# EAGLE schematic LM_180622 (EAGLE 7.7.1)

## Sheet 1 of 6
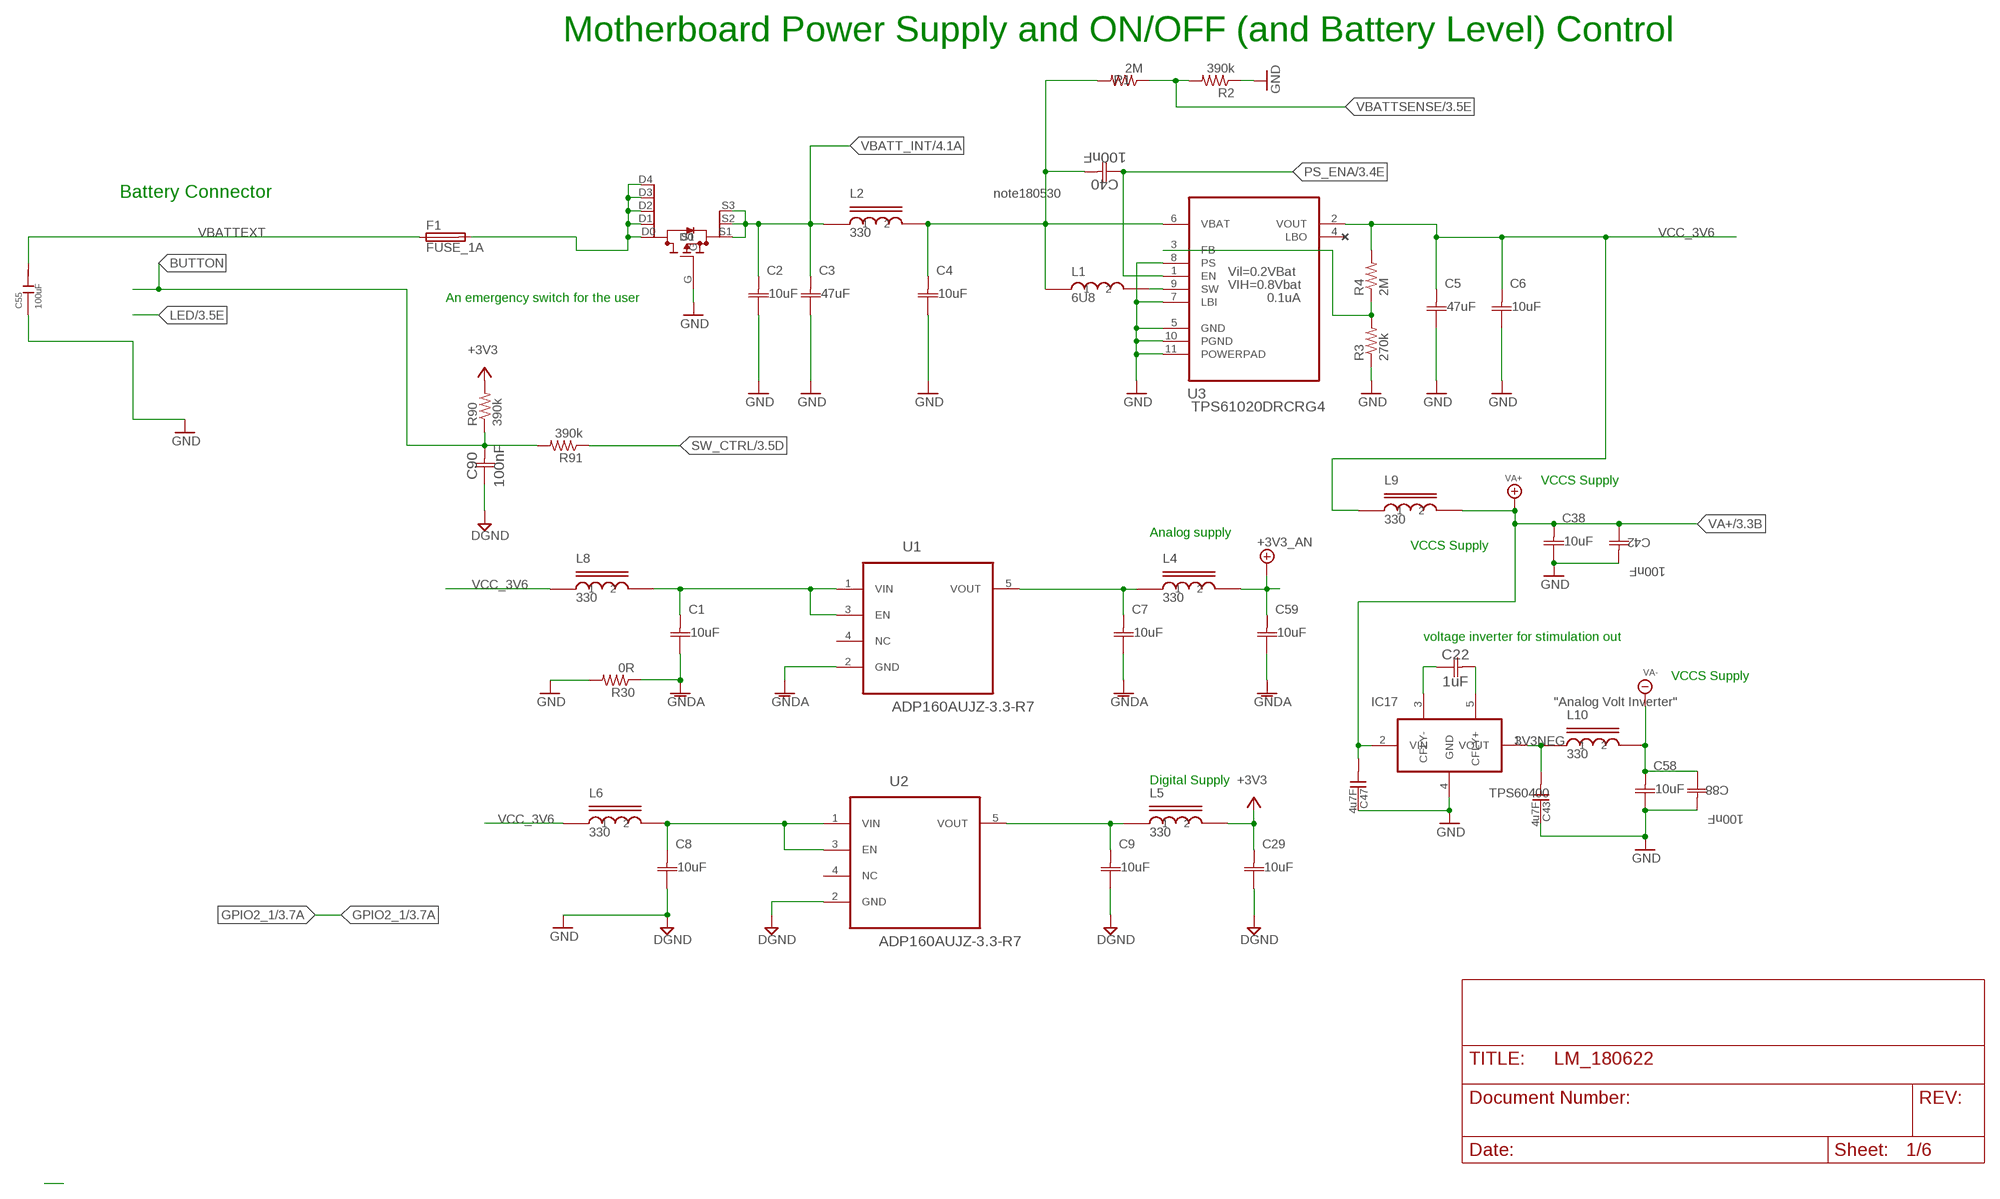
[diagram p0: schematic, sheet 1]

### Parts
C1  10uF  C0603C106M9PACTU  [C0603]
C2  10uF  C0603C106M9PACTU  [C0603]
C3  47uF  C0805C476M9PACTU  [C0805]
C4  10uF  C0603C106M9PACTU  [C0603]
C5  47uF  C0805C476M9PACTU  [C0805]
C6  10uF  C0603C106M9PACTU  [C0603]
C7  10uF  C0603C106M9PACTU  [C0603]
C8  10uF  C0603C106M9PACTU  [C0603]
C9  10uF  C0603C106M9PACTU  [C0603]
C22  1uF  C0603C105K3PACTU  [0603-CAP]
C29  10uF  C0603C106M9PACTU  [C0603]
C38  10uF  C0603C106M9PACTU  [C0603]
C40  100nF  C100NFC0603  [C0603]
C42  100nF  C100NFC0603  [C0603]
C43  4u7F  C0805_4U7  [C0805]
C47  4u7F  C0805_4U7  [C0805]
C55  100uF  C100UF-6V3-1210  [C1210]
C58  10uF  C0603C106M9PACTU  [C0603]
C59  10uF  C0603C106M9PACTU  [C0603]
C88  100nF  C100NFC0603  [C0603]
C90  100nF  C100NFC0603  [C0603]
F1  FUSE_1A  [C0805]
IC17  TPS60400  [SOT23-5]
L1  6U8  B82462G4682M  [SMT_POWER_IND_B82462G4]
L2  330  MMZ1608B301C  [L0603]
L4  330  MMZ1608B301C  [L0603]
L5  330  MMZ1608B301C  [L0603]
L6  330  MMZ1608B301C  [L0603]
L8  330  MMZ1608B301C  [L0603]
L9  330  MMZ1608B301C  [L0603]
L10  330  MMZ1608B301C  [L0603]
PMOS1  SIS407DN  [POWERPAK1212-8SINGLE]
R1  2M  R2MR0603  [R0603]
R2  390k  R390KR0603  [R0603]
R3  270k  R270KR0603  [R0603]
R4  2M  R2MR0603  [R0603]
R30  0R  R0RR0603  [R0603]
R90  390k  R390KR0603  [R0603]
R91  390k  R390KR0603  [R0603]
U1  ADP160AUJZ-3.3-R7  [SOT95P280X100-5N]
U2  ADP160AUJZ-3.3-R7  [SOT95P280X100-5N]
U3  TPS61020DRCRG4  [SON50P300X300X100-11N]

### Nets
3V3NEG [pwr]: C43.1 IC17.1(VOUT) L10.1
+3V3 [pwr]: C29.2(C2) L5.2 R90.2 ; also sheet 3,4
+3V3_AN [pwr]: C59.2(C2) L4.2 ; also sheet 2,3
A3V6 [pwr]: C1.2(C2) L8.2 U1.1(VIN) U1.3(EN)
BUTTON: C90.2(C2) R90.1 R91.2 ; also sheet 3
FB_3V6 [signal]: R3.2 R4.1 U3.3(FB)
GND [cGnd]: C2.1(C1) C3.1(C1) C4.1(C1) C5.1(C1) C6.1(C1) C8.1(C1) C9.1(C1) C29.1(C1) C38.1(C1) C42.2(C2) C43.2 C47.2 C55.1 C58.1(C1) C88.2(C2) C90.1(C1) IC17.4(GND) PMOS1.G R2.1 R3.1 R30.2 U2.2(GND) U3.5(GND) U3.7(LBI) U3.8(PS) U3.10(PGND) U3.11(POWERPAD) ; supply symbol labelled DGND ; also sheet 3,4,5,6
GNDA: C1.1(C1) C7.1(C1) C59.1(C1) R30.1 U1.2(GND) ; also sheet 2,3
N$1 [pwr]: F1.2 PMOS1.D0 PMOS1.D1 PMOS1.D2 PMOS1.D3 PMOS1.D4
N$3: L1.2 U3.9(SW)
N$7 [pwr]: C7.2(C2) L4.1 U1.5(VOUT)
N$9 [pwr]: C9.2(C2) L5.1 U2.5(VOUT)
N$21 [pwr]: C8.2(C2) L6.2 U2.1(VIN) U2.3(EN)
N$92: C22.1(C1) IC17.3(CFLY-)
N$93: C22.2(C2) IC17.5(CFLY+)
PS_ENA: C40.1(C1) U3.1(EN) ; also sheet 3
SW_CTRL: R91.1 ; also sheet 3
VA+ [pwr]: C38.2(C2) C42.1(C1) C47.1 IC17.2(VIN) L9.2 ; also sheet 3,5
VA- [pwr]: C58.2(C2) C88.1(C1) L10.2 ; also sheet 3,5
VBATT_INT [pwr]: C2.2(C2) C3.2(C2) L2.1 PMOS1.S1 PMOS1.S2 PMOS1.S3 ; also sheet 4
VBATTEXT [pwr]: C55.2 F1.1 ; also sheet 3
VBATTSENSE: R1.1 R2.2 ; also sheet 3
VBATU3 [pwr]: C4.2(C2) C40.2(C2) L1.1 L2.2 R1.2 U3.6(VBAT)
VCC_3V6 [pwr]: C5.2(C2) C6.2(C2) L6.1 L8.1 L9.1 R4.2 U3.2(VOUT)
Unconnected: U1.4(NC) U2.4(NC) U3.4(LBO)

### Notes on the sheet
- Motherboard Power Supply and ON/OFF (and Battery Level) Control
- Battery Connector | note180530
- Vil=0.2VBat
- VIH=0.8Vbat
- An emergency switch for the user | 0.1uA
- VCCS Supply
- 180525
  antibounce circuit for external pushbutton
- Analog supply
- VCCS Supply
- voltage inverter for stimulation out
- VCCS Supply
- "Analog Volt Inverter"
- Digital Supply

## Sheet 2 of 6
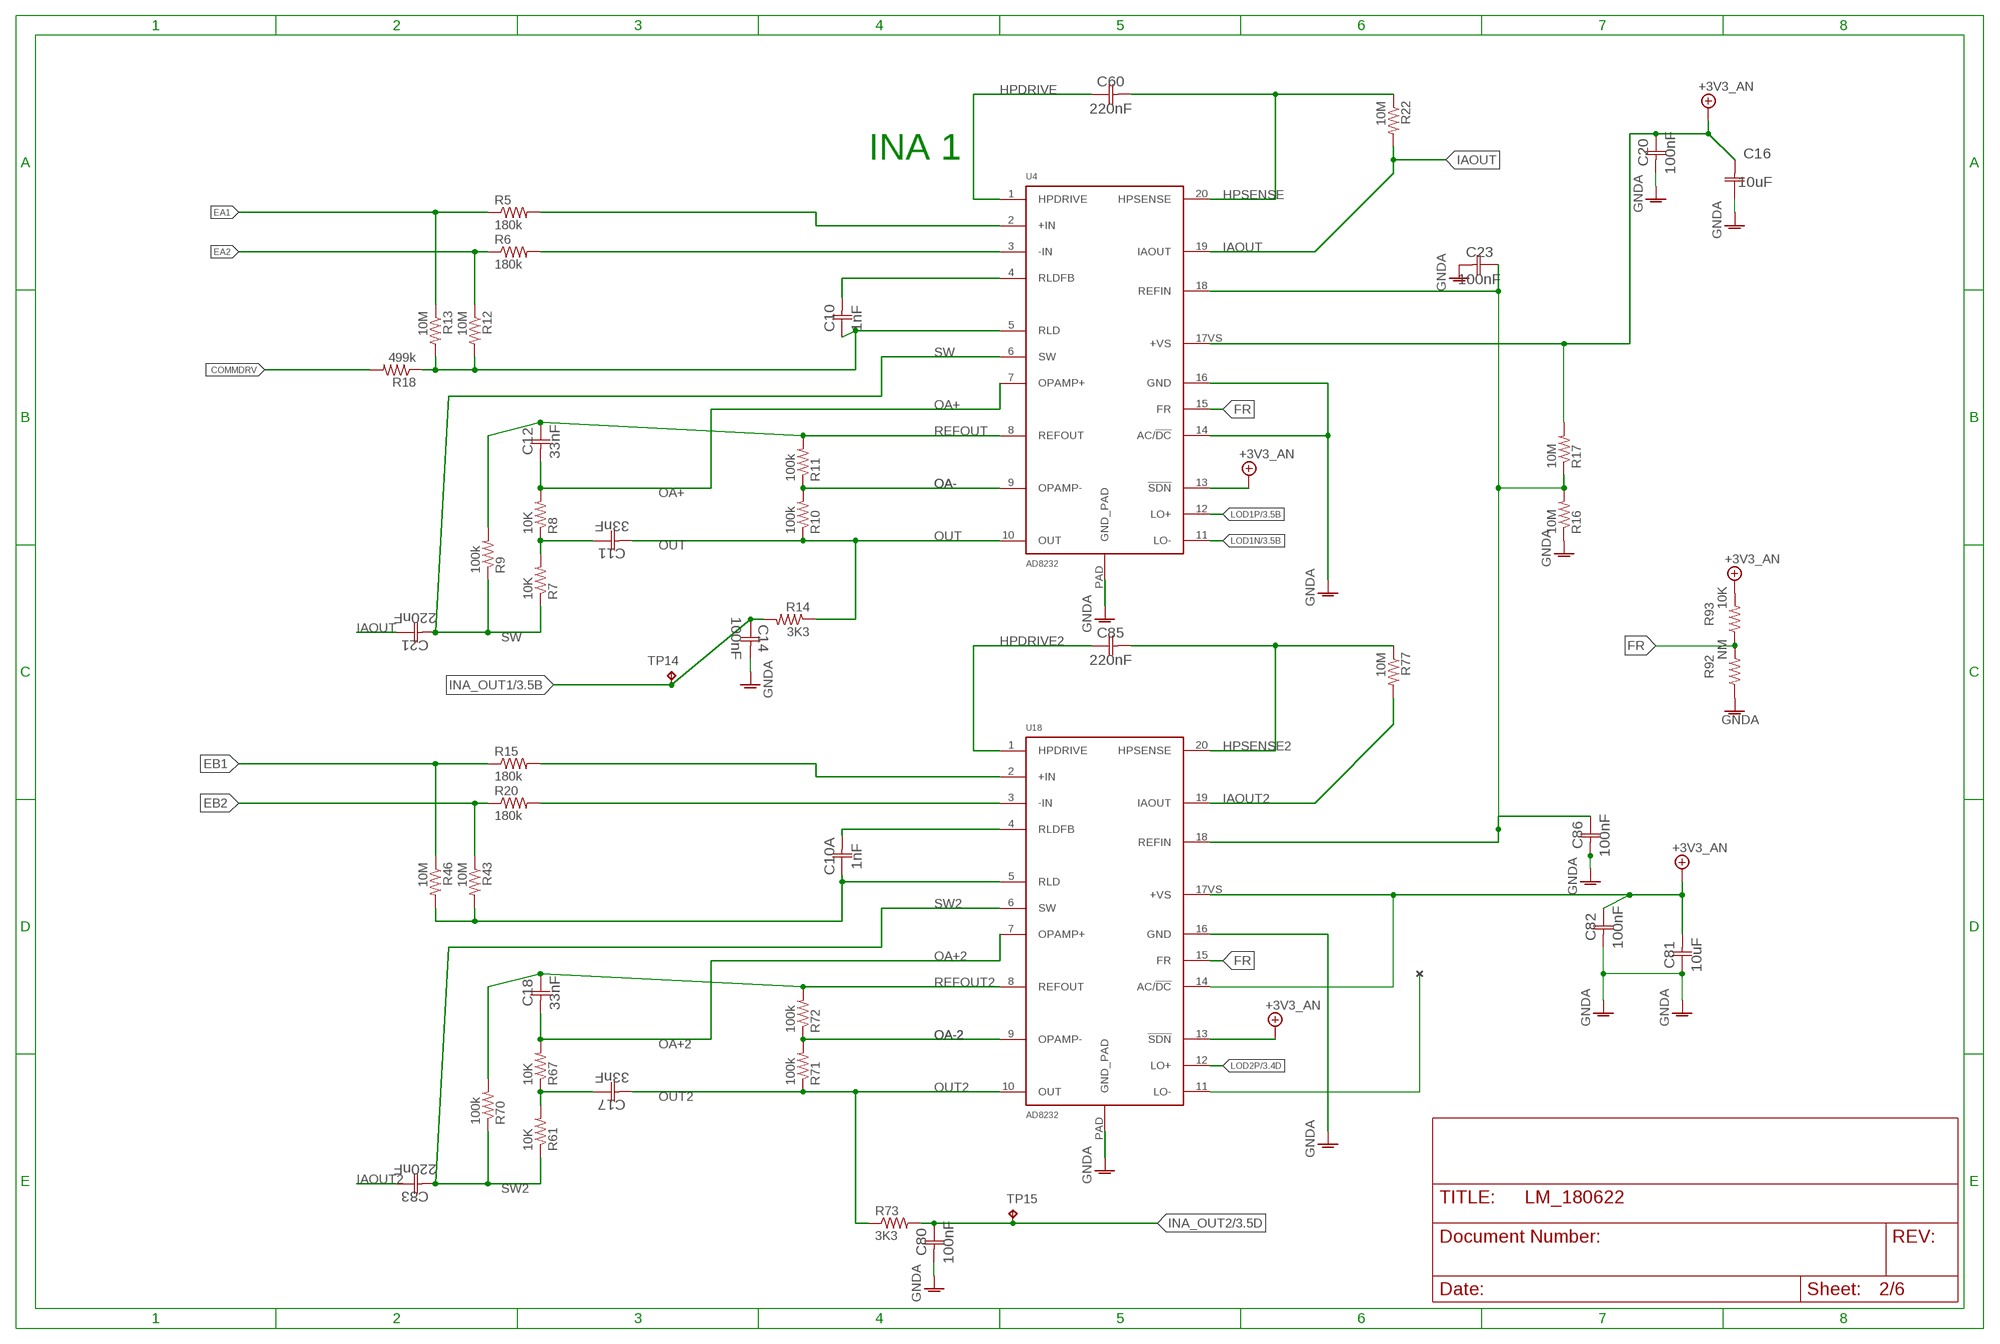
[diagram p1: schematic, sheet 2]

### Parts
C10  1nF  C0603C102J5GACTU  [C0603]
C10A  1nF  C0603C102J5GACTU  [C0603]
C11  33nF  C33NFC0603  [C0603]
C12  33nF  C33NFC0603  [C0603]
C14  100nF  C100NFC0603  [C0603]
C16  10uF  C0603C106M9PACTU  [C0603]
C17  33nF  C33NFC0603  [C0603]
C18  33nF  C33NFC0603  [C0603]
C20  100nF  C100NFC0603  [C0603]
C21  220nF  C0603C224K3RACTU  [C0603]
C23  100nF  C100NFC0603  [C0603]
C60  220nF  C0603C224K3RACTU  [C0603]
C80  100nF  C100NFC0603  [C0603]
C81  10uF  C0603C106M9PACTU  [C0603]
C82  100nF  C100NFC0603  [C0603]
C83  220nF  C0603C224K3RACTU  [C0603]
C85  220nF  C0603C224K3RACTU  [C0603]
C86  100nF  C100NFC0603  [C0603]
R5  180k  R180KR0603  [R0603]
R6  180k  R180KR0603  [R0603]
R7  10K  R10KR0603  [R0603]
R8  10K  R10KR0603  [R0603]
R9  100k  R100KR0603  [R0603]
R10  100k  R100KR0603  [R0603]
R11  100k  R100KR0603  [R0603]
R12  10M  R10MR0603  [R0603]
R13  10M  R10MR0603  [R0603]
R14  3K3  R3K3R0603  [R0603]
R15  180k  R180KR0603  [R0603]
R16  10M  R10MR0603  [R0603]
R17  10M  R10MR0603  [R0603]
R18  499k  R499KR0603  [R0603]
R20  180k  R180KR0603  [R0603]
R22  10M  R10MR0603  [R0603]
R43  10M  R10MR0603  [R0603]
R46  10M  R10MR0603  [R0603]
R61  10K  R10KR0603  [R0603]
R67  10K  R10KR0603  [R0603]
R70  100k  R100KR0603  [R0603]
R71  100k  R100KR0603  [R0603]
R72  100k  R100KR0603  [R0603]
R73  3K3  R3K3R0603  [R0603]
R77  10M  R10MR0603  [R0603]
R92  NM  RESISTOR0603-RES  [R0603]
R93  10K  R10KR0603  [R0603]
TP14  NM  TPB1,27  [B1,27]
TP15  NM  TPB1,27  [B1,27]
U4  AD8232  [LFCSP_20]
U18  AD8232  [LFCSP_20]

### Nets
+3V3_AN [pwr]: C16.2(C2) C20.1(C1) C81.2(C2) C82.1(C1) R17.2 R93.2 U4.13(!SDN) U4.17VS(+VS) U18.13(!SDN) U18.14(AC/!DC) U18.17VS(+VS) ; also sheet 1,3
COMMDRV: R18.2 ; also sheet 3
EA1: R5.1 R13.1 ; also sheet 3
EA2: R6.1 R12.1 ; also sheet 3
EB1: R15.1 R46.1 ; also sheet 3
EB2: R20.1 R43.1 ; also sheet 3
FR: R92.2 R93.1 U4.15(FR) U18.15(FR)
GNDA: C14.2(C2) C16.1(C1) C20.2(C2) C23.2(C2) C80.2(C2) C81.1(C1) C82.2(C2) C86.2(C2) R16.1 R92.1 U4.14(AC/!DC) U4.16(GND) U4.PAD(GND_PAD) U18.16(GND) U18.PAD(GND_PAD) ; also sheet 1,3
HPDRIVE: C60.1(C1) U4.1(HPDRIVE)
HPDRIVE2: C85.1(C1) U18.1(HPDRIVE)
HPSENSE: C60.2(C2) R22.1 U4.20(HPSENSE)
HPSENSE2: C85.2(C2) R77.1 U18.20(HPSENSE)
IAOUT: C21.1(C1) R22.2 U4.19(IAOUT)
IAOUT2: C83.1(C1) R77.2 U18.19(IAOUT)
INA_OUT1: C14.1(C1) R14.2 TP14.TP ; also sheet 3
INA_OUT2: C80.1(C1) R73.2 TP15.TP ; also sheet 3
LOD1N: U4.11(LO-) ; also sheet 3
LOD1P: U4.12(LO+) ; also sheet 3
LOD2P: U18.12(LO+) ; also sheet 3
N$11: R5.2 U4.2(+IN)
N$12: R6.2 U4.3(-IN)
N$13: C11.1(C1) R7.2 R8.1
N$14: C10A.2(C2) U18.4(RLDFB)
N$15: C10A.1(C1) R43.2 R46.2 U18.5(RLD)
N$20: C10.2(C2) U4.4(RLDFB)
N$22: C10.1(C1) R12.2 R13.2 R18.1 U4.5(RLD)
N$30: U18.11(LO-)
N$64: R15.2 U18.2(+IN)
N$65: R20.2 U18.3(-IN)
N$67: C17.1(C1) R61.2 R67.1
OA+: C12.2(C2) R8.2 U4.7(OPAMP+)
OA+2: C18.2(C2) R67.2 U18.7(OPAMP+)
OA-: R10.2 R11.1 U4.9(OPAMP-)
OA-2: R71.2 R72.1 U18.9(OPAMP-)
OUT: C11.2(C2) R10.1 R14.1 U4.10(OUT)
OUT2: C17.2(C2) R71.1 R73.1 U18.10(OUT)
REFOUT: C12.1(C1) R9.2 R11.2 U4.8(REFOUT)
REFOUT2: C18.1(C1) R70.2 R72.2 U18.8(REFOUT)
SW: C21.2(C2) R7.1 R9.1 U4.6(SW)
SW2: C83.2(C2) R61.1 R70.1 U18.6(SW)
VREFIN: C23.1(C1) C86.1(C1) R16.2 R17.1 U4.18(REFIN) U18.18(REFIN)

### Notes on the sheet
- rev180525
- ok
- 10Meg
- INA 1
- ok
- ok
- ok
- ok
- Eval board jumper in P4
- ok
- AN R17'
- AN C9
- AN R13' | AN R16' | AN C10'
- AN C8
- ok | AN R10 | 3k3,100n=>F0=480Hz
- AN C4 | 33n
- rev180525
- rev180525
- AC detection Only LOD+ active
- rev180525

## Sheet 3 of 6
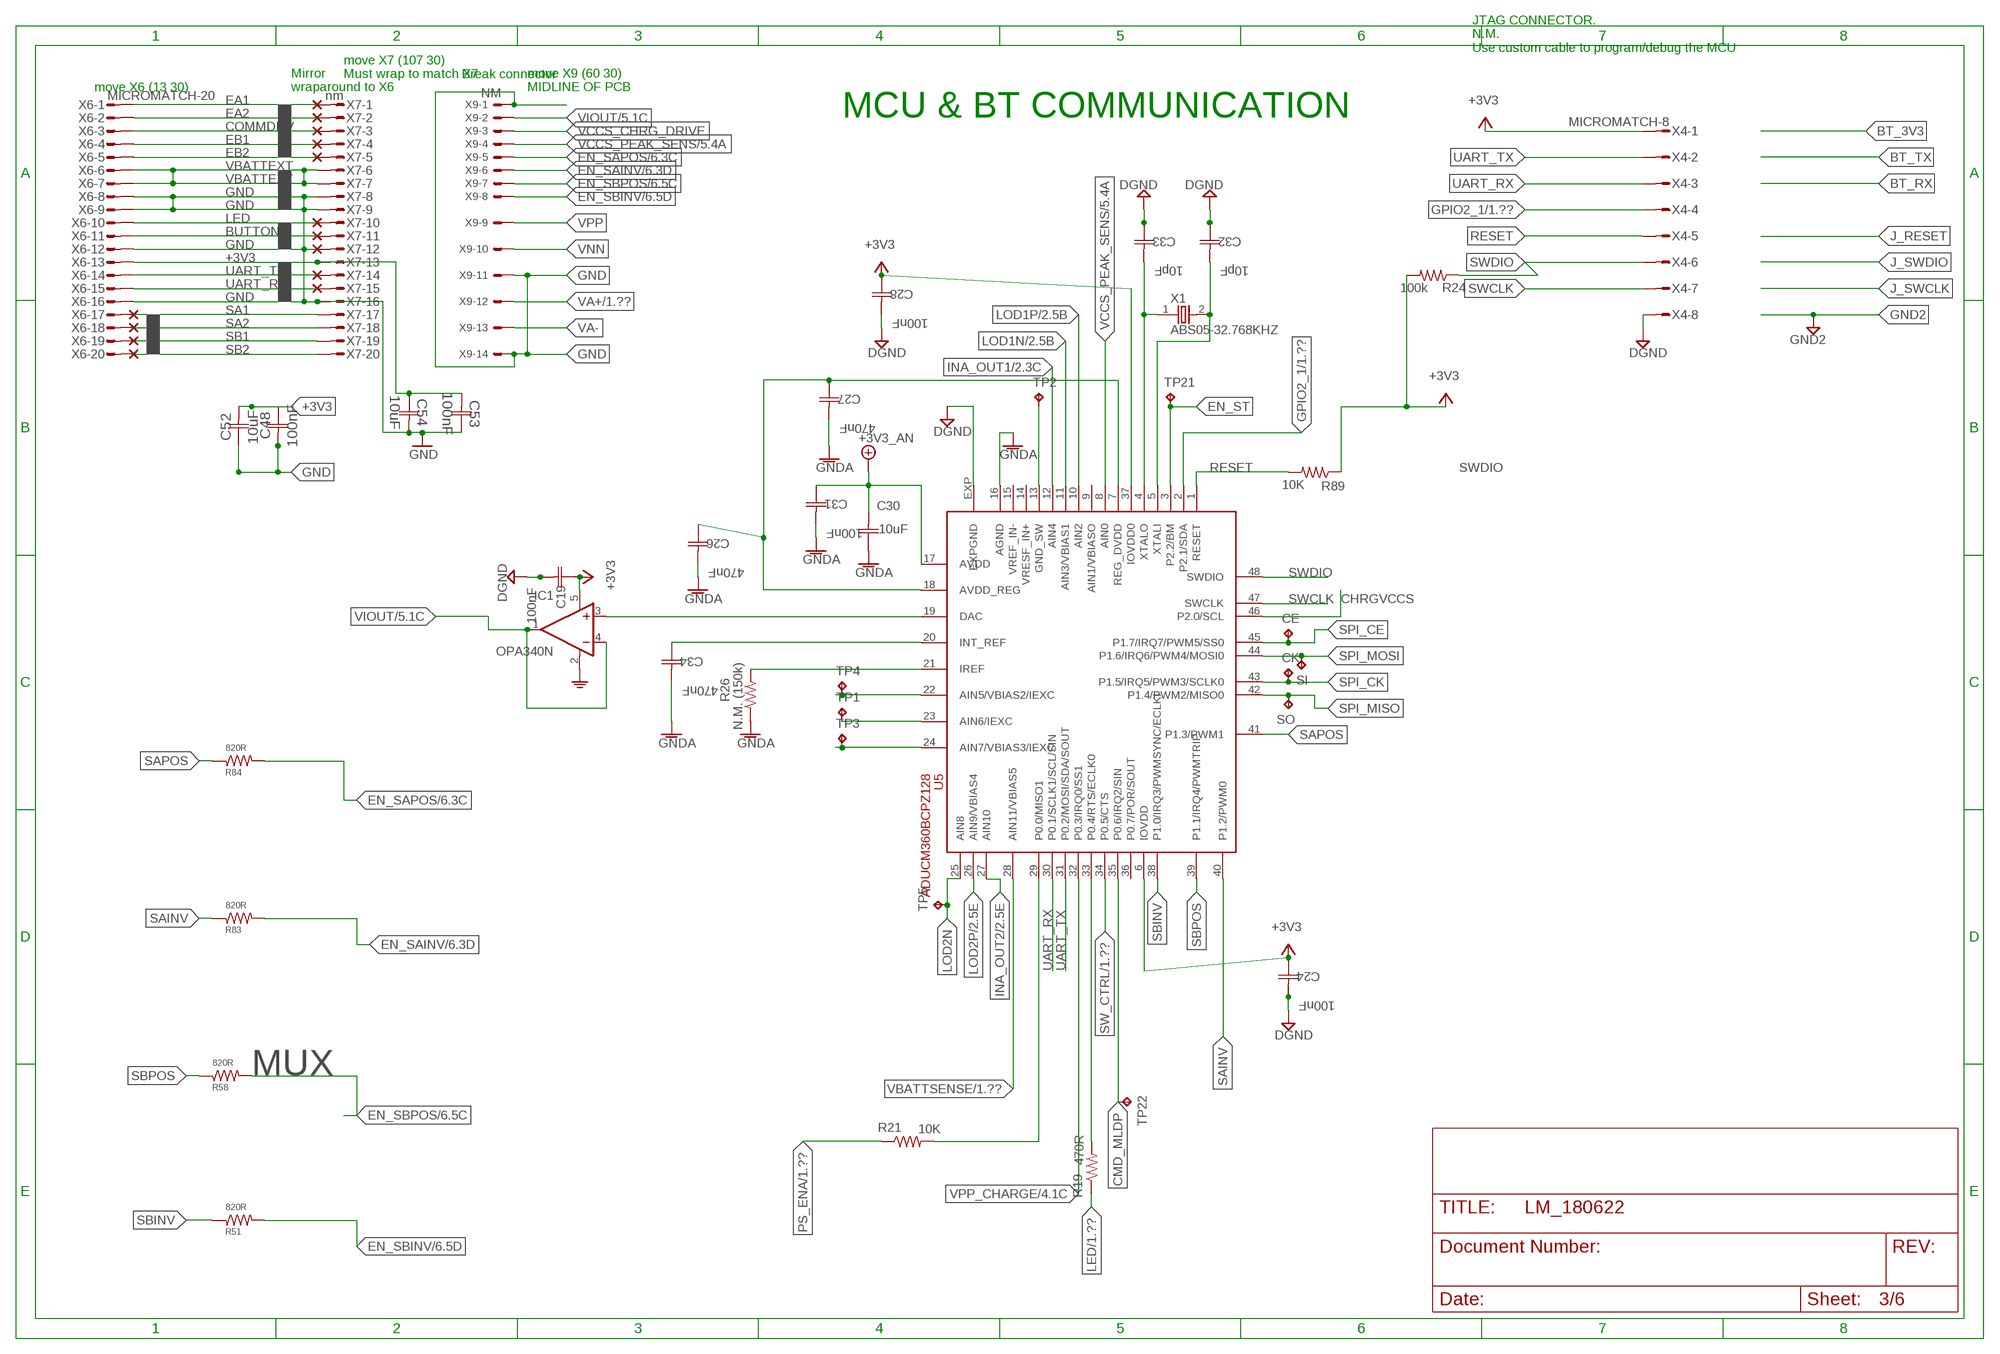
[diagram p2: schematic, sheet 3]

### Parts
C19  100nF  C100NFC0603  [C0603]
C24  100nF  C100NFC0603  [C0603]
C26  470nF  C0603C474K4RACTU  [C0603]
C27  470nF  C0603C474K4RACTU  [C0603]
C28  100nF  C100NFC0603  [C0603]
C30  10uF  C0603C106M9PACTU  [C0603]
C31  100nF  C100NFC0603  [C0603]
C32  10pF  C0603C100J5GACTU  [C0603]
C33  10pF  C0603C100J5GACTU  [C0603]
C34  470nF  C0603C474K4RACTU  [C0603]
C48  100nF  C100NFC0603  [C0603]
C52  10uF  C0603C106M9PACTU  [C0603]
C53  100nF  C100NFC0603  [C0603]
C54  10uF  C0603C106M9PACTU  [C0603]
CE  NM  TPLM  [TH0305]
CK  NM  TPLM  [TH0305]
IC1  OPA340N  [SOT23-5]
R19  470R  RESISTOR0603-RES  [R0603]
R21  10K  R10KR0603  [R0603]
R24  100k  R100KR0603  [R0603]
R26  N.M. (150k)  RESISTOR0603-RES  [R0603]
R51  820R  R820RR0603  [R0603]
R58  820R  R820RR0603  [R0603]
R83  820R  R820RR0603  [R0603]
R84  820R  R820RR0603  [R0603]
R89  10K  R10KR0603  [R0603]
SI  NM  TPLM  [TH0305]
SO  NM  TPLM  [TH0305]
TP1  NM  TPLM  [TH0305]
TP2  NM  TPLM  [TH0305]
TP3  NM  TPLM  [TH0305]
TP4  NM  TPLM  [TH0305]
TP5  NM  TPLM  [TH0305]
TP21  NM  TPLM  [TH0305]
TP22  NM  TPLM  [TH0305]
U5  ADUCM360BCPZ128  [LFCSP48]
X1  ABS05-32.768KHZ  ABS05-32.768KHZ-T2PIN  [CRYSTAL-2PIN]
X4  MICROMATCH-8  [MICROMATCH-8]
X6  MICROMATCH-20  [MICROMATCH-20]
X7  nm  MICROMATCH-20  [MICROMATCH-20]
X9  NM  C-GRID-14-70543  [70543-14]

### Nets
3V3_BT: C53.2(C2) C54.1(C1) X7.13
+3V3 [pwr]: C19.1(C1) C24.1(C1) C28.1(C1) C48.1(C1) C52.2(C2) IC1.5(V+) R24.2 R89.1 U5.6(IOVDD) U5.37(IOVDD0) X4.1 X6.13 ; also sheet 1,4
+3V3_AN [pwr]: C30.2(C2) C31.1(C1) U5.17(AVDD) ; also sheet 1,2
BUTTON: X6.11 ; also sheet 1
CHRGVCCS: U5.46(P2.0/SCL) ; also sheet 5
CMD_MLDP: TP22.TP U5.35(P0.6/IRQ2/SIN)
COMMDRV: X6.3 ; also sheet 2
EA1: X6.1 ; also sheet 2
EA2: X6.2 ; also sheet 2
EB1: X6.4 ; also sheet 2
EB2: X6.5 ; also sheet 2
EN_SAINV: R83.2 X9.6 ; also sheet 6
EN_SAPOS: R84.2 X9.5 ; also sheet 6
EN_SBINV [signal]: R51.2 X9.8 ; also sheet 6
EN_SBPOS: R58.2 X9.7 ; also sheet 6
EN_ST: TP21.TP U5.3(P2.2/BM)
GND [cGnd]: C19.2(C2) C24.2(C2) C28.2(C2) C32.1(C1) C33.1(C1) C48.2(C2) C52.1(C1) C53.1(C1) C54.2(C2) IC1.2(V-) U5.EXP(EXPGND) X4.8 X6.8 X6.9 X6.12 X6.16 X7.8 X7.9 X7.12 X7.16 X9.1 X9.11 X9.14 ; supply symbol labelled DGND ; also sheet 1,4,5,6
GNDA: C26.2(C2) C27.2(C2) C30.1(C1) C31.2(C2) C34.2(C2) R26.1 U5.16(AGND) ; also sheet 1,2
GPIO2_1: U5.2(P2.1/SDA) X4.4 ; also sheet 1
INA_OUT1: U5.12(AIN4) ; also sheet 2
INA_OUT2: U5.27(AIN10) ; also sheet 2
LED: R19.1 X6.10 ; also sheet 1
LED_CTRL1: R19.2 U5.33(P0.4/RTS/ECLK0)
LOD1N: U5.11(AIN3/VBIAS1) ; also sheet 2
LOD1P: U5.10(AIN2) ; also sheet 2
LOD2N: TP5.TP U5.25(AIN8)
LOD2P: U5.26(AIN9/VBIAS4) ; also sheet 2
N$10: C33.2(C2) U5.4(XTALO) X1.1
N$16 [signal]: C26.1(C1) C27.1(C1) U5.7(REG_DVDD) U5.18(AVDD_REG)
N$17: TP1.TP U5.23(AIN6/IEXC)
N$19: C32.2(C2) U5.5(XTALI) X1.2
N$23: R26.2 U5.21(IREF)
N$24: C34.1(C1) U5.20(INT_REF)
N$28: R21.2 U5.29(P0.0/MISO1)
N$29: TP2.TP U5.13(GND_SW)
N$37: X7.5
N$46: X7.6 X7.7
N$49: X7.10
N$50: X7.11
N$60: X7.14
N$63: X7.15
N$68: X7.4
N$69: X7.3
N$71: IC1.3(+IN) U5.19(DAC)
N$75: X7.2
N$76: X7.1
N$77 [cHV]: X6.17
N$79 [cHV]: X6.18
N$80 [cHV]: X6.19
N$83 [cHV]: X6.20
N$87: TP3.TP U5.24(AIN7/VBIAS3/IEXC)
N$88: TP4.TP U5.22(AIN5/VBIAS2/IEXC)
PS_ENA: R21.1 ; also sheet 1
RESET: R89.2 U5.1(RESET) X4.5
SA1 [cPPLS]: X7.17 ; also sheet 6
SA2 [cHV]: X7.18 ; also sheet 6
SAINV: R83.1 U5.40(P1.2/PWM0)
SAPOS: R84.1 U5.41(P1.3/PWM1)
SB1 [cHV]: X7.19 ; also sheet 6
SB2 [cHV]: X7.20 ; also sheet 6
SBINV: R51.1 U5.38(P1.0/IRQ3/PWMSYNC/ECLKI)
SBPOS: R58.1 U5.39(P1.1/IRQ4/PWMTRIP)
SPI_CE: CE.TP U5.45(P1.7/IRQ7/PWM5/SS0)
SPI_CK: CK.TP U5.43(P1.5/IRQ5/PWM3/SCLK0)
SPI_MISO: SO.TP U5.42(P1.4/PWM2/MISO0)
SPI_MOSI: SI.TP U5.44(P1.6/IRQ6/PWM4/MOSI0)
SW_CTRL: U5.34(P0.5/CTS) ; also sheet 1
SWCLK: U5.47(SWCLK) X4.7
SWDIO: R24.1 U5.48(SWDIO) X4.6
UART_RX: U5.30(P0.1/SCLK1/SCL/SIN) X4.3 X6.15
UART_TX: U5.31(P0.2/MOSI/SDA/SOUT) X4.2 X6.14
VA+ [pwr]: X9.12 ; also sheet 1,5
VA- [pwr]: X9.13 ; also sheet 1,5
VBATTEXT [pwr]: X6.6 X6.7 ; also sheet 1
VBATTSENSE: U5.28(AIN11/VBIAS5) ; also sheet 1
VCCS_CHRG_DRIVE: X9.3 ; also sheet 5
VCCS_PEAK_SENS: U5.8(AIN0) X9.4 ; also sheet 5
VIOUT: IC1.1(OUT) IC1.4(-IN) X9.2 ; also sheet 5
VNN [cHV]: X9.10 ; also sheet 4,5
VPP [cHV]: X9.9 ; also sheet 4,5
VPP_CHARGE: U5.32(P0.3/IRQ0/SS1) ; also sheet 4
Unconnected: U5.9(AIN1/VBIASO) U5.14(VRESF_IN+) U5.15(VREF_IN-) U5.36(P0.7/POR/SOUT)

### Notes on the sheet
- JTAG CONNECTOR.
  N.M.
  Use custom cable to program/debug the MCU
- move X7 (107 30)
  Must wrap to match X7
- Break connector
- move X6 (13 30)
- Mirror
  wraparound to X6
- move X9 (60 30)
  MIDLINE OF PCB
- MCU & BT COMMUNICATION
- done180525
- todo1 consider using a *244* driver
- MUX

## Sheet 4 of 6
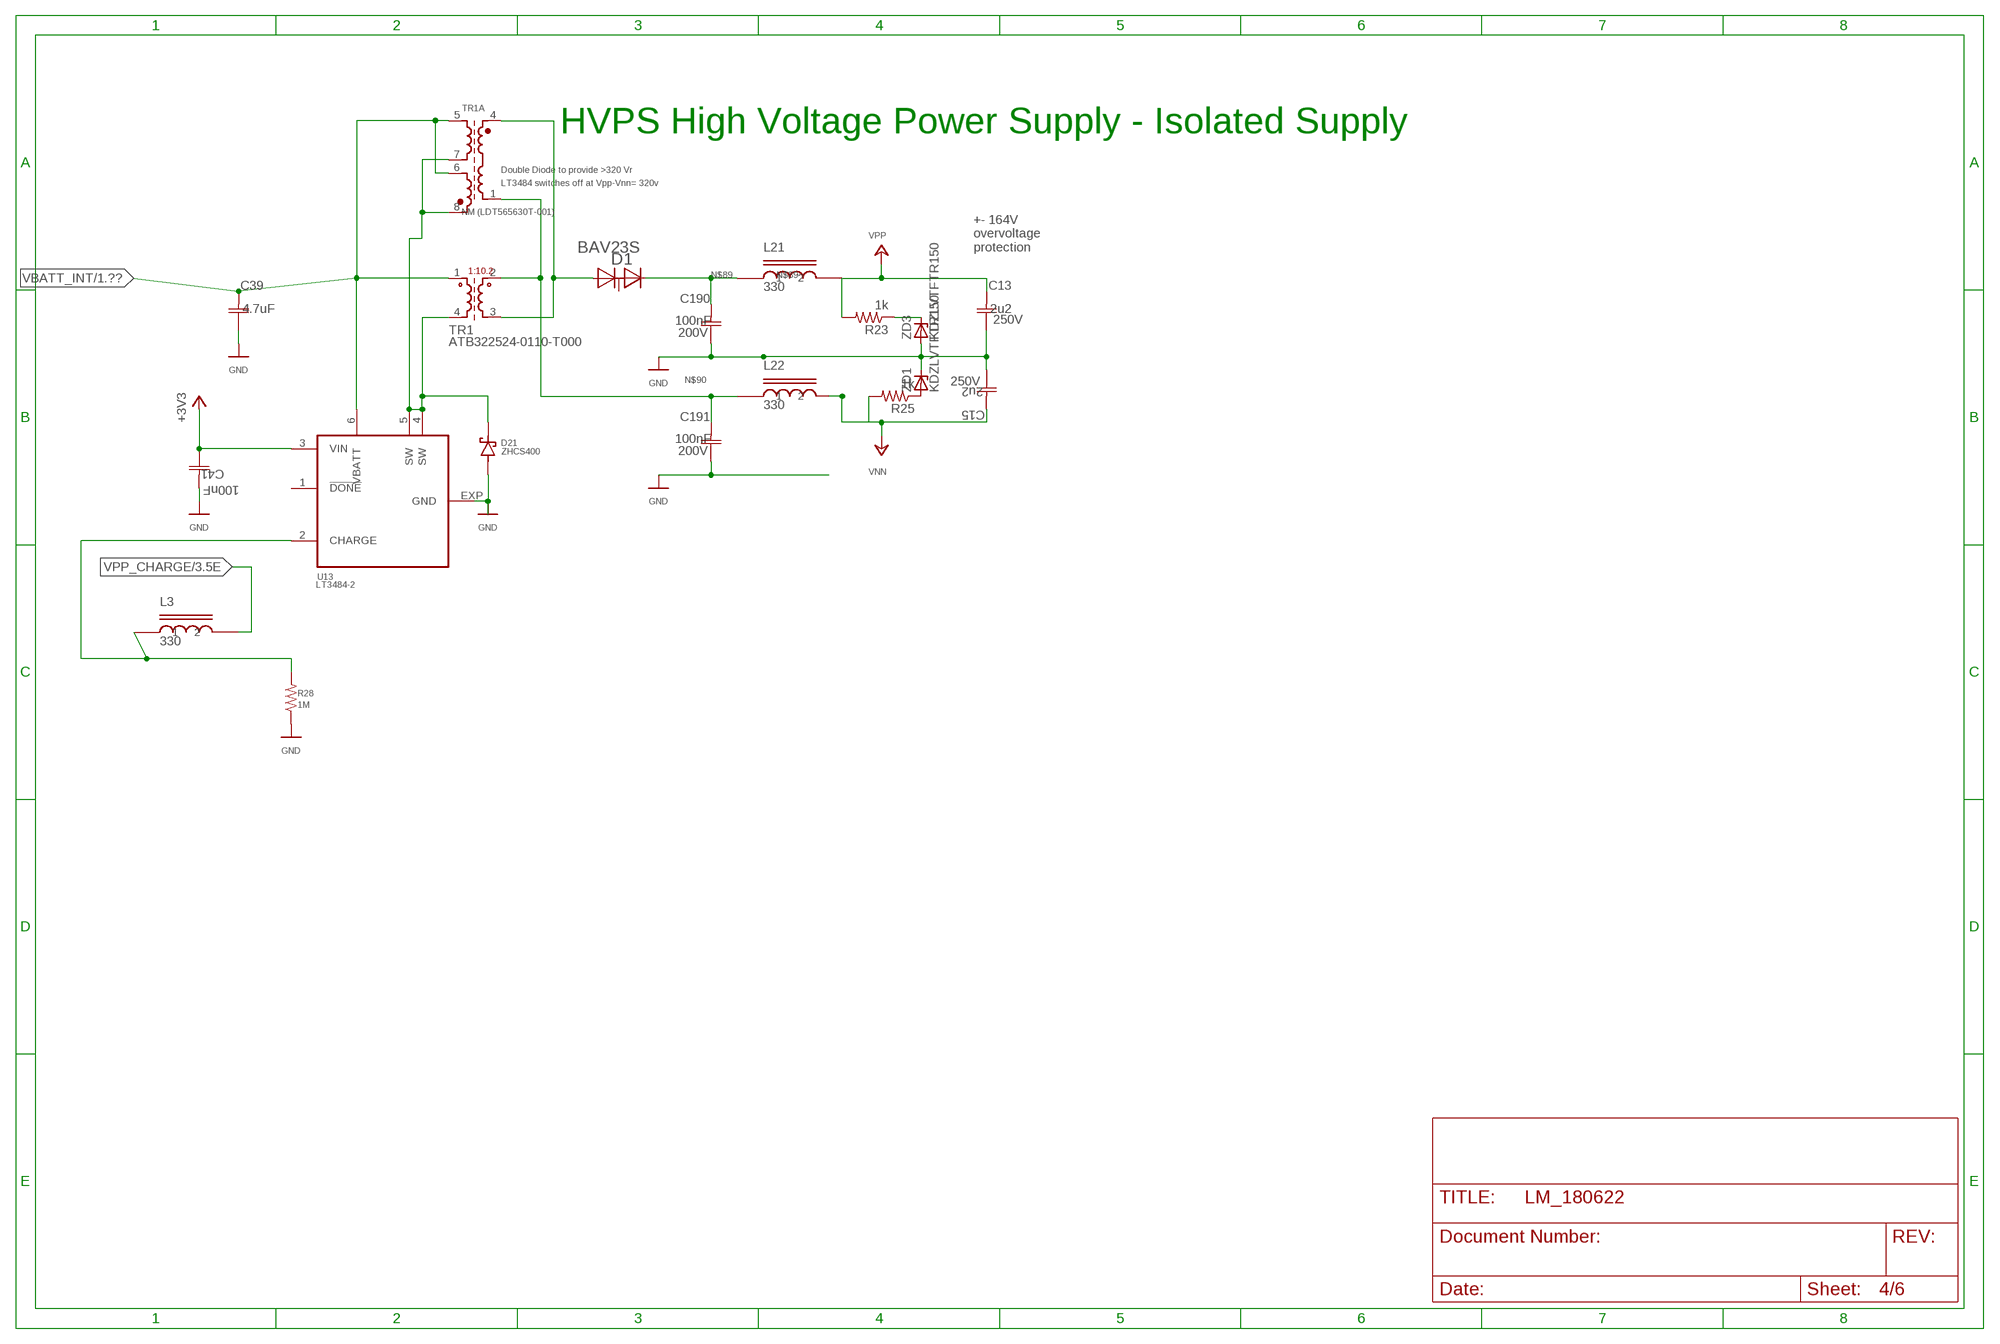
[diagram p3: schematic, sheet 4]

### Parts
C13  2u2  CGA9P3X7T2E225K250KA  [C2220K]
C15  2u2  CGA9P3X7T2E225K250KA  [C2220K]
C39  4.7uF  C0603C475K9PACTU  [C0603]
C41  100nF  C100NFC0603  [C0603]
C190  100nF  12062C104KAT2A  [1206]
C191  100nF  12062C104KAT2A  [1206]
D1  BAV23S  [SOT23]
D21  ZHCS400  [SOD323]
L3  330  MMZ1608B301C  [L0603]
L21  330  MMZ1608B301C  [L0603]
L22  330  MMZ1608B301C  [L0603]
R23  1k  R1KR0603  [R0603]
R25  1k  R1KR0603  [R0603]
R28  1M  R1MR0603  [R0603]
TR1  ATB322524-0110-T000  [3225_4PIN]
TR1A  NM (LDT565630T-001)  LDT565630T-001  [SM-E6]
U13  LT3484-2  LT3484  [DFN6-2X3]
ZD1  KDZLVTFTR150  [SOD123]
ZD3  KDZLVTFTR150  [SOD123]

### Nets
+3V3 [pwr]: C41.1(C1) U13.3(VIN) ; also sheet 1,3
GND [cGnd]: C13.1(C1) C15.1(C1) C39.1(C1) C41.2(C2) C190.1(C1) C191.1(C1) D21.A(1A) R28.1 U13.EXP(GND) ZD1.1C(C) ZD3.2A(A) ; also sheet 1,3,5,6
LT_CHRG: L3.1 R28.2 U13.2(CHARGE)
N$2: R23.1 ZD3.1C(C)
N$4: R25.1 ZD1.2A(A)
N$31 [cHV]: D1.1 TR1.3 TR1A.4
N$89 [cHV]: C190.2(C2) D1.2 L21.1
N$90 [cHV]: C191.2(C2) L22.1 TR1.2 TR1A.1
N_SW2: D21.K(2C) TR1.4 TR1A.7 TR1A.8 U13.4(SW) U13.5(SW)
VBATT_INT [pwr]: C39.2(C2) TR1.1 TR1A.5 TR1A.6 U13.6(VBATT) ; also sheet 1
VNN [cHV]: C15.2(C2) L22.2 R25.2 ; also sheet 3,5
VPP [cHV]: C13.2(C2) L21.2 R23.2 ; also sheet 3,5
VPP_CHARGE: L3.2 ; also sheet 3
Unconnected: D1.3 U13.1(!DONE)

### Notes on the sheet
- HVPS High Voltage Power Supply - Isolated Supply
- Double Diode to provide >320 Vr
- LT3484 switches off at Vpp-Vnn= 320v
- +- 164V 
  overvoltage 
  protection

## Sheet 5 of 6
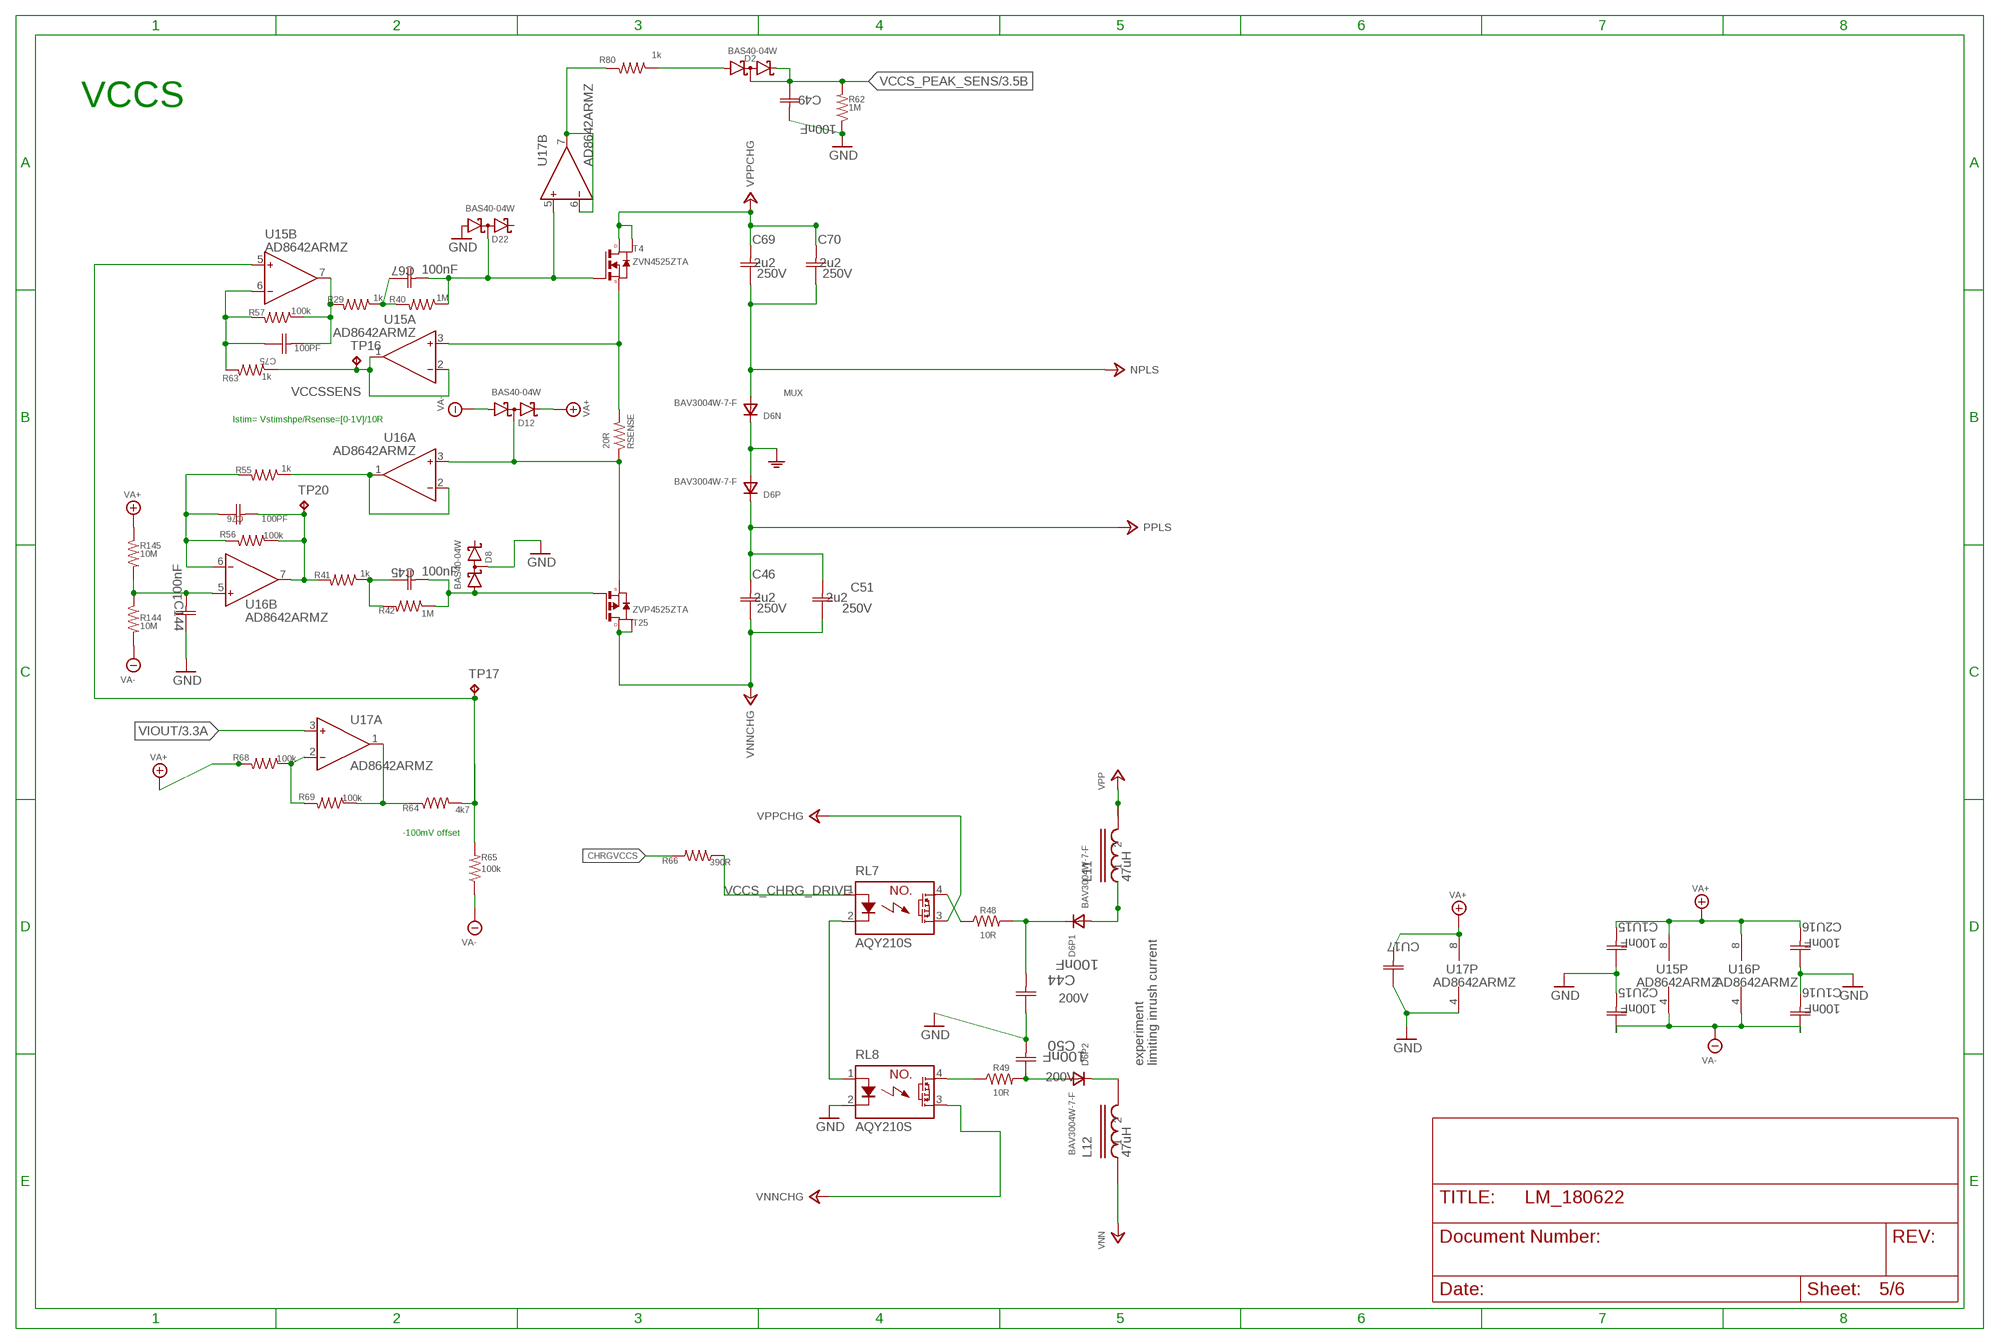
[diagram p4: schematic, sheet 5]

### Parts
C1U15  100nF  C100NFC0603  [C0603]
C1U16  100nF  C100NFC0603  [C0603]
C2U15  100nF  C100NFC0603  [C0603]
C2U16  100nF  C100NFC0603  [C0603]
C44  100nF  12062C104KAT2A  [1206]
C45  100nF  C100NFC0603  [C0603]
C46  2u2  CGA9P3X7T2E225K250KA  [C2220K]
C49  100nF  C100NFC0603  [C0603]
C50  100nF  12062C104KAT2A  [1206]
C51  2u2  CGA9P3X7T2E225K250KA  [C2220K]
C67  100nF  C100NFC0603  [C0603]
C69  2u2  CGA9P3X7T2E225K250KA  [C2220K]
C70  2u2  CGA9P3X7T2E225K250KA  [C2220K]
C75  100PF  0603YC101KAT4A  [C0603]
C76  100PF  0603YC101KAT4A  [C0603]
C144  100nF  C100NFC0603  [C0603]
CU17  100nF  C100NFC0603  [C0603]
D2  BAS40-04W  BAS40-04W115  [SOT323]
D6N  BAV3004W-7-F  [SOD123]
D6P  BAV3004W-7-F  [SOD123]
D6P1  BAV3004W-7-F  [SOD123]
D6P2  BAV3004W-7-F  [SOD123]
D8  BAS40-04W  BAS40-04W115  [SOT323]
D12  BAS40-04W  BAS40-04W115  [SOT323]
D22  BAS40-04W  BAS40-04W115  [SOT323]
L11  47uH  LQH31MN470K03L  [1206]
L12  47uH  LQH31MN470K03L  [1206]
R29  1k  R1KR0603  [R0603]
R40  1M  R1MR0603  [R0603]
R41  1k  R1KR0603  [R0603]
R42  1M  R1MR0603  [R0603]
R48  10R  RESISTOR0603-RES  [R0603]
R49  10R  RESISTOR0603-RES  [R0603]
R55  1k  R1KR0603  [R0603]
R56  100k  R100KR0603  [R0603]
R57  100k  R100KR0603  [R0603]
R62  1M  R1MR0603  [R0603]
R63  1k  R1KR0603  [R0603]
R64  4k7  R4K7R0603  [R0603]
R65  100k  R100KR0603  [R0603]
R66  390R  R390RR0603  [R0603]
R68  100k  R100KR0603  [R0603]
R69  100k  R100KR0603  [R0603]
R80  1k  R1KR0603  [R0603]
R144  10M  R10MR0603  [R0603]
R145  10M  R10MR0603  [R0603]
RL7  AQY210S  [SOP04]
RL8  AQY210S  [SOP04]
RSENSE  20R  R20RR2010  [R2010]
T4  ZVN4525ZTA  [SOT89]
T25  ZVP4525ZTA  [SOT89]
TP16  NM  TPLM  [TH0305]
TP17  NM  TPLM  [TH0305]
TP20  NM  TPLM  [TH0305]
U15  AD8642ARMZ  [MSOP8]
U16  AD8642ARMZ  [MSOP8]
U17  AD8642ARMZ  [MSOP8]

### Nets
CHRGVCCS: R66.2 ; also sheet 3
GND [cGnd]: C1U15.1(C1) C1U16.2(C2) C2U15.2(C2) C2U16.1(C1) C44.1(C1) C49.2(C2) C50.2(C2) C144.1(C1) CU17.1(C1) D6N.C D6P.A D8.3(C1A2) D22.1(A1) R62.1 RL8.2(K) U17.4(P:V-) ; also sheet 1,3,4,6
N$5: C75.2(C2) R29.2 R57.1 U15.7(B:OUT)
N$8: R80.2 U17.6(B:IN-) U17.7(B:OUT)
N$18 [cHV]: D6P2.C L12.2
N$25 [cHV]: C50.1(C1) D6P2.A R49.2
N$26 [cHV]: D6P1.A L11.1
N$27 [cHV]: C44.2(C2) D6P1.C R48.2
N$33: C76.2(C2) R41.2 R56.1 TP20.TP U16.7(B:OUT)
N$35: R55.1 U16.1(A:OUT) U16.2(A:IN-)
N$39: C76.1(C1) R55.2 R56.2 U16.6(B:IN-)
N$42: C75.1(C1) R57.2 R63.2 U15.6(B:IN-)
N$52: R64.1 R69.1 U17.1(A:OUT)
N$54: C144.2(C2) R144.1 R145.2 U16.5(B:IN+)
N$55: C67.1(C1) R29.1 R40.2
N$56: R68.1 R69.2 U17.2(A:IN-)
N$61 [cHV]: R49.1 RL8.4(DS1)
N$62: D2.1(A1) R80.1
N$70: R48.1 RL7.4(DS1)
N$78: C45.1(C1) R41.1 R42.2
NAQY: RL7.2(K) RL8.1(A)
NG1B: C67.2(C2) D22.3(C1A2) R40.1 T4.1(G) U17.5(B:IN+)
NG1B1: C45.2(C2) D8.1(A1) R42.1 T25.1(G)
NPLS: C69.1(C1) C70.1(C1) D6N.A ; also sheet 6
NS1A: D12.3(C1A2) RSENSE.1 T25.3(S) U16.3(A:IN+)
NSB: RSENSE.2 T4.3(S) U15.3(A:IN+)
PLSCTRL1: R64.2 R65.2 TP17.TP U15.5(B:IN+)
PPLS: C46.2(C2) C51.2(C2) D6P.C ; also sheet 6
VA+ [pwr]: C1U15.2(C2) C2U16.2(C2) CU17.2(C2) D12.2(C2) R68.2 R145.1 U15.8(P:V+) U16.8(P:V+) U17.8(P:V+) ; also sheet 1,3
VA- [pwr]: C1U16.1(C1) C2U15.1(C1) D12.1(A1) R65.1 R144.2 U15.4(P:V-) U16.4(P:V-) ; also sheet 1,3
VCCS_CHRG_DRIVE: R66.1 RL7.1(A) ; also sheet 3
VCCS_PEAK_SENS: C49.1(C1) D2.2(C2) D2.3(C1A2) R62.2 ; also sheet 3
VCCSSENS: R63.1 TP16.TP U15.1(A:OUT) U15.2(A:IN-)
VIOUT: U17.3(A:IN+) ; also sheet 3
VNN [cHV]: L12.1 ; also sheet 3,4
VNNCHG [cHV]: C46.1(C1) C51.1(C1) RL8.3(DS2) T25.2(D2) T25.4(D3)
VPP [cHV]: L11.2 ; also sheet 3,4
VPPCHG [cHV]: C69.2(C2) C70.2(C2) RL7.3(DS2) T4.2(D1) T4.4(D2)
Unconnected: D8.2(C2) D22.2(C2)

### Notes on the sheet
- VCCS
- move to MCU sheet
- MUX
- Istim= Vstimshpe/Rsense=[0-1V]/10R
- Rev 23/4-/Done feedback & Vbatt(Ub) Vin separation
- -100mV offset
- move to MCU sheet
- experiment 
  limiting inrush current

## Sheet 6 of 6
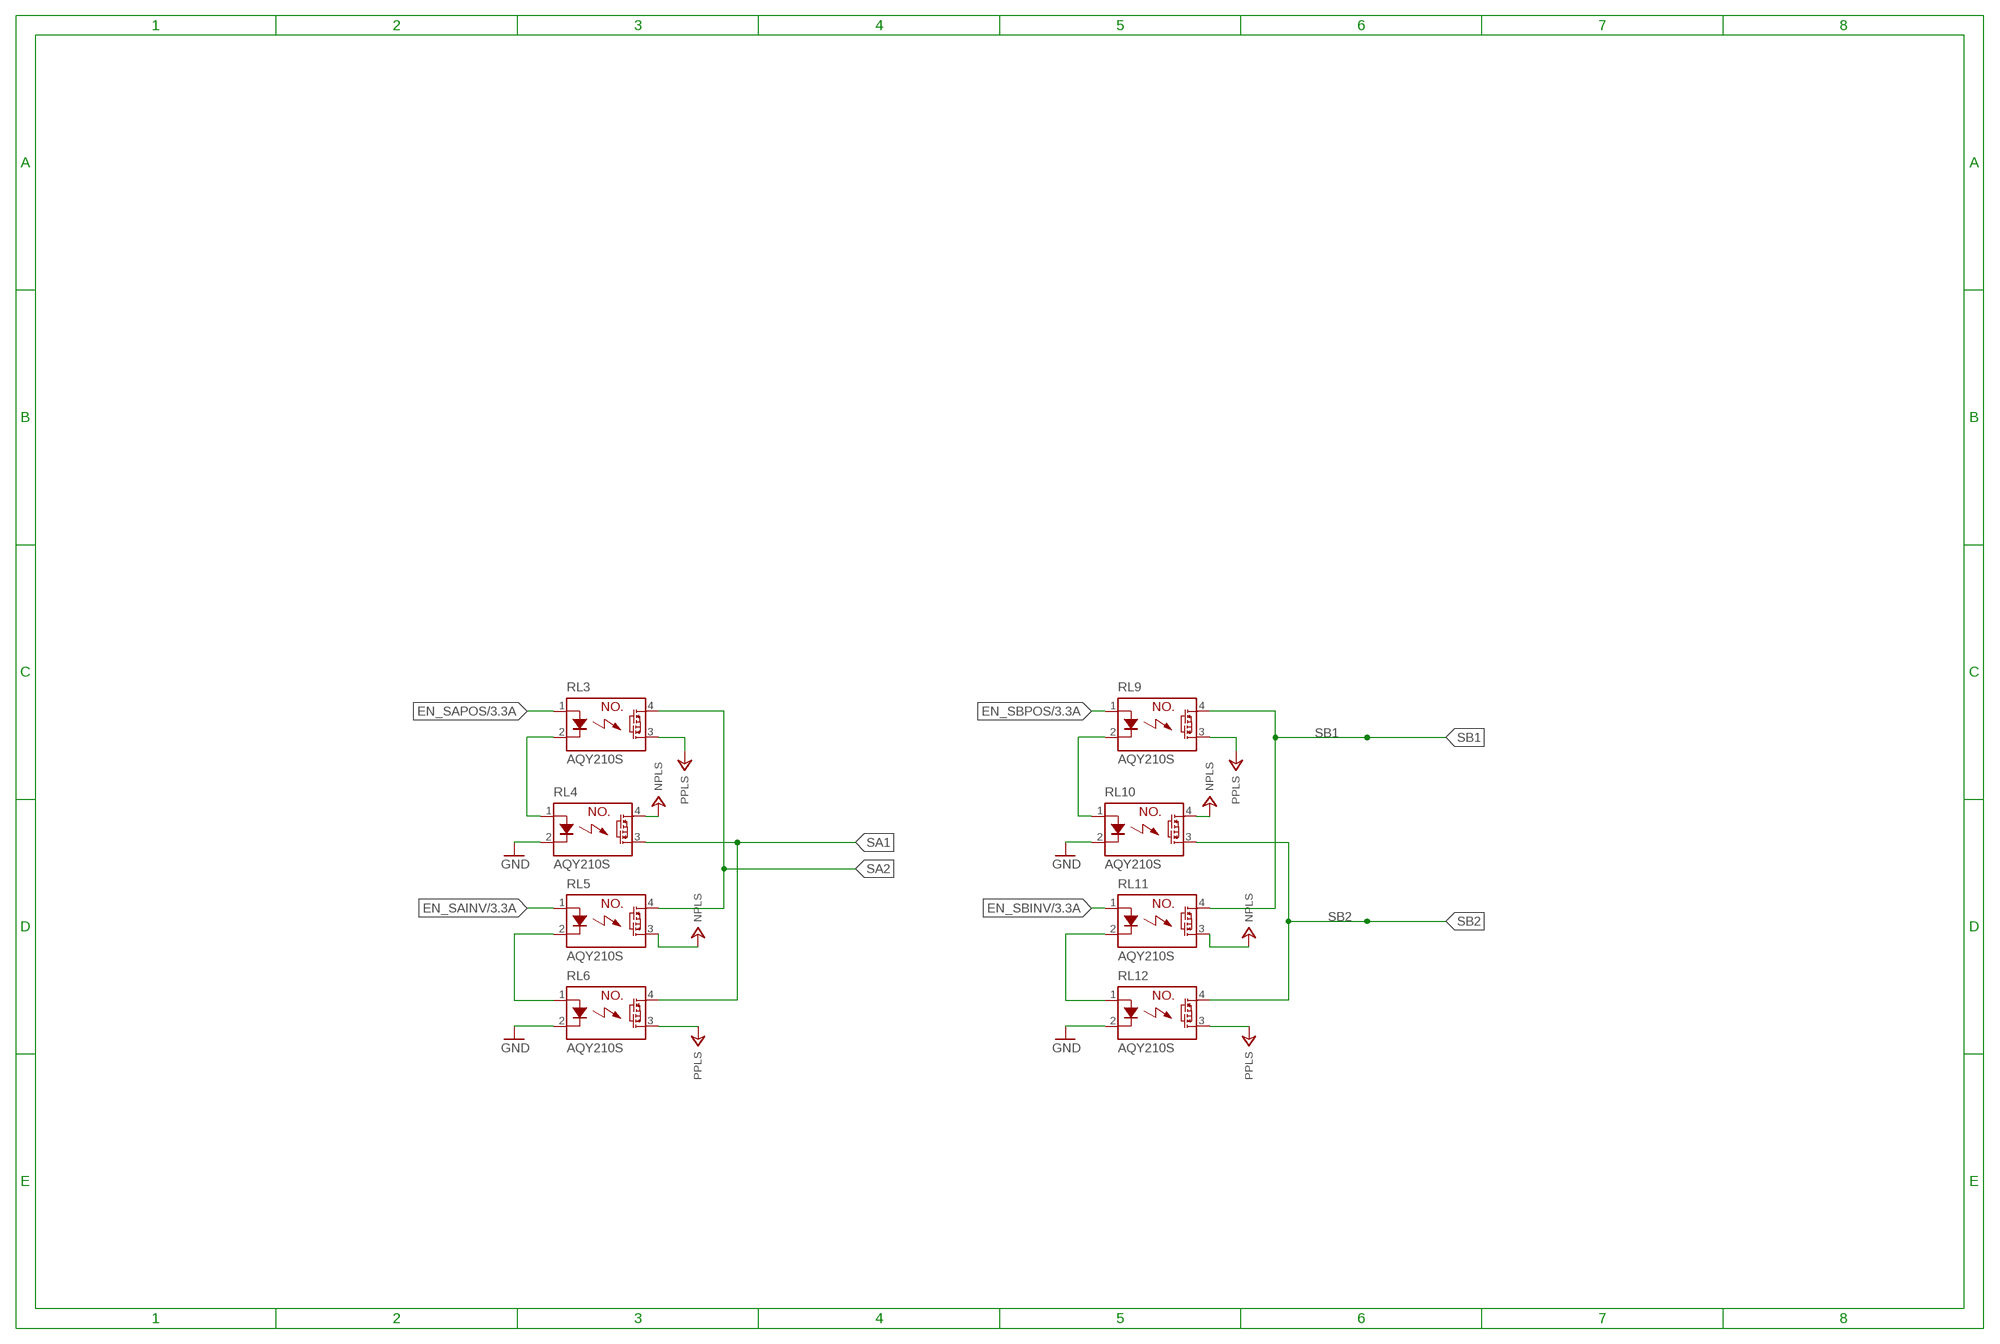
[diagram p5: schematic, sheet 6]

### Parts
RL3  AQY210S  [SOP04]
RL4  AQY210S  [SOP04]
RL5  AQY210S  [SOP04]
RL6  AQY210S  [SOP04]
RL9  AQY210S  [SOP04]
RL10  AQY210S  [SOP04]
RL11  AQY210S  [SOP04]
RL12  AQY210S  [SOP04]

### Nets
EN_SAINV: RL5.1(A) ; also sheet 3
EN_SAPOS: RL3.1(A) ; also sheet 3
EN_SBINV [signal]: RL11.1(A) ; also sheet 3
EN_SBPOS: RL9.1(A) ; also sheet 3
GND [cGnd]: RL4.2(K) RL6.2(K) RL10.2(K) RL12.2(K) ; also sheet 1,3,4,5
N$51: RL3.2(K) RL4.1(A)
N$53: RL5.2(K) RL6.1(A)
N$81: RL9.2(K) RL10.1(A)
N$82: RL11.2(K) RL12.1(A)
NPLS: RL4.4(DS1) RL5.3(DS2) RL10.4(DS1) RL11.3(DS2) ; also sheet 5
PPLS: RL3.3(DS2) RL6.3(DS2) RL9.3(DS2) RL12.3(DS2) ; also sheet 5
SA1 [cPPLS]: RL4.3(DS2) RL6.4(DS1) ; also sheet 3
SA2 [cHV]: RL3.4(DS1) RL5.4(DS1) ; also sheet 3
SB1 [cHV]: RL9.4(DS1) RL11.4(DS1) ; also sheet 3
SB2 [cHV]: RL10.3(DS2) RL12.4(DS1) ; also sheet 3

## Library data of the parts
C1 C2 C4 C6-C9 C16 C29 C30 C38 C52 C54 C58 C59 C81 = LM_library:C0603C106M9PACTU: CAPACITOR, 0603; MPN: C0603C106M9PACTU; OC_FARNELL: 1288201; OC_NEWARK: 93K5998; TOLERANCE: ±20%; VOLTAGERATING: 6.3V
C1U15 C1U16 C2U15 C2U16 C19 C20 C23 C24 C28 C31 C40-C42 C45 C48 C49 C53 C67 C82 C86 C88 C90 C144 CU17 = LM_library:C100NFC0603; MPN: C0603C104K5RACTU; OC_EC: C0603C104K5RACTU; OC_FARNELL: 1692286; OC_NEWARK: 97H5226; TOLERANCE: ±10%; VOLTAGERATING: 50V
C3 C5 = LM_library:C0805C476M9PACTU: CAPACITOR, 0805; MPN: C0805C476M9PACTU; OC_FARNELL: 1572633; OC_NEWARK: 94M5641; TOLERANCE: ±20%; VOLTAGERATING: 6.3V
C10 C10A = LM_library:C0603C102J5GACTU: CAPACITOR, 0603; MPN: C0603C102J5GACTU; OC_FARNELL: 1414605; OC_NEWARK: 86H9967; TOLERANCE: ±5%; VOLTAGERATING: 50V
C11 C12 C17 C18 = LM_library:C33NFC0603; OC_FARNELL: 1865549; OC_NEWARK: unknown; TOLERANCE: ±10%; VOLTAGERATING: 100V
C13 C15 C46 C51 C69 C70 = LM_library:CGA9P3X7T2E225K250KA: Multilayer Ceramic Capacitors MLCC - SMD/SMT CGA 2220 250V 2.2uF X7T 10% T: 2.5mm; MPN: ECA-2GHG2R2; OC_FARNELL: 2435510; OC_MOUSER: 810-CGA9P3X7T2E225K; OC_NEWARK: 96K9250; TOLERANCE: ±10%; VOLTAGERATING: 250V
C14 C80 = LM_library:C100NFC0603; MPN: C0603C104K5RACTU; OC_FARNELL: 1692286; OC_NEWARK: 97H5226; TOLERANCE: ±10%; VOLTAGERATING: 50V
C21 C60 C83 C85 = LM_library:C0603C224K3RACTU: CAPACITOR, 0603; MPN: C0603C224K3RACTU; OC_FARNELL: 1414626; OC_NEWARK: 93K6000; TOLERANCE: ±10%; VOLTAGERATING: 25V
C22 = cap:C0603C105K3PACTU: CAPACITOR, 0603; DESCRIPTION: X5R; MPN: C0603C105K3PACTU; OC_FARNELL: 1288202; OC_NEWARK: 93K5996; TOLERANCE: ±10%; VOLTAGERATING: 25V
C26 C27 C34 = LM_library:C0603C474K4RACTU: CAPACITOR, 0603; MPN: C0603C474K4RACTU; OC_FARNELL: 1414644; OC_NEWARK: 53M7214; TOLERANCE: ±10%; VOLTAGERATING: 16V
C32 C33 = LM_library:C0603C100J5GACTU: CAPACITOR, 0603; MPN: C0603C100J5GACTU; OC_FARNELL: 1414601; OC_NEWARK: 64K2831; TOLERANCE: ±5%; VOLTAGERATING: 50V
C39 = LM_library:C0603C475K9PACTU: CAPACITOR, 0603; MPN: C0603C475K9PACTU; OC_FARNELL: 9227784; OC_NEWARK: 70K9096; TOLERANCE: ±10%; VOLTAGERATING: 6.3V
C43 C47 = cap:C0805_4U7: GRM21BR60J475KA11L - Murata 4.7µF ±10% 6.3V Ceramic Capacitor X5R 0805 (2012 Metric); MFC: GRM21BR60J475KA11L; OC_NEWARK: unknown
C44 C50 C190 C191 = LM_library:12062C104KAT2A: Capacitor 1206; MPN: 12062C104KAT2A; OC_EC: 12062C104KAT2A; OC_FARNELL: 1867950; OC_NEWARK: 88K1723; TOLERANCE: ±10%; VOLTAGERATING: 200V
C55 = LM_library:C100UF-6V3-1210: TDK 100μF Multilayer Ceramic Capacitor MLCC 6.3V dc ±20% X5R Dielectric 1210 (3225M) SMD, Max. Temp. +85°C; DESCRIPTION: TDK 100μF Multilayer Ceramic Capacitor MLCC 6.3V dc ±20% X5R Dielectric 1210 (3225M) SMD, Max. Temp. +85°C; EURO: 0.2; MPN: JMK325BJ107MY-T; OC_NEWARK: 08P5158; OC_RS: 740-7685
C75 C76 = LM_library:0603YC101KAT4A: Capacitor, 0603; OC_EC: 0603YC101KAT4A; OC_FARNELL: -; OC_NEWARK: unknown; TOLERANCE: ±10%; VOLTAGERATING: 16V
CE CK SI SO TP1-TP5 TP16 TP17 TP20-TP22 = LM_library:TP: Test pad; OC_NEWARK: unknown
D1 = Mecfes_RT:BAV23S: VRRM Maximum Repetitive Reverse Voltage 250 V IF(AV) Average Rectified Forward Current 200 mA IR Reverse Leakage VR = 250V VR = 250V, 100 nA trr Reverse Recovery Time IF = IR = 30mA, IRR = 3.0mA, RL = 100? 50 ns; MPN: BAV23S-7-F; OC_NEWARK: 66W0890
D2 D8 D12 D22 = diodes:BAS40-04W: Silicon Schottky Diodes General-purpose diode for high-speed switching . .Main product characteristics Features and benefits ? Very low conduction losses ? Negligible switching losses ? Low forward and reverse recovery times ? Surface mount device ? Low capacitance diode ? Low resistance and inductance Description The BAS70 series uses 70 V Schottky barrier diodes packaged in SOD-123, SOD-323, SOD- 523, SOT-23, SOT-323, SOT-323-6L or SOT-666. These diodes are specially suited for signal detection and temperature compensation in RF applications. Order codes IF 70 mA VRRM 70 V C (max) 2 pF Tj (max) 150° C; MPN: BAS40-04W 115.; OC_FARNELL: 2438943; OC_NEWARK: 15AC2175
D6N D6P D6P1 D6P2 = LM_library:BAV3004W-7-F; DESCRIPTION: 350V; MPN: BAV3004W-7-F; OC_FARNELL: 2306032; OC_NEWARK: 65W8484
D21 = LM_library:ZHCS400: ZHCS400 - Diode Inc Diode Schottky 40V 400mA (DC) Surface Mount SOD-323; DESCR: 400V IF:0.4A; MPN: ZHCS400; OC_FARNELL: 9525149; OC_NEWARK: 98K3993
F1 = LM_library:FUSE_1A; MPN: 0805L100WR; OC_FARNELL: 1832106; OC_NEWARK: 05M2230
IC1 = Burr-brown:OPA340: Rail-to-Rail Operational Amplifiers Single-Supply, MicroAmplifier(TM) Series; MPN: OPA340NA/3K; OC_FARNELL: 1234805; OC_NEWARK: 13M5177
IC17 = Luca_MecFes:TPS60400; MPN: TPS60400DBVR; OC_NEWARK: 01X3151
L1 = LM_library:B82462G4682M; MPN: B82462G4682M000; OC_FARNELL: 7430019; OC_MOUSER: 871-B82462G4682M; OC_NEWARK: 46P6096
L2-L6 L8-L10 L21 L22 = LM_library:MMZ1608B301C; OC_NEWARK: unknown; PARTNO: MMZ1608B301C
L11 L12 = LM_library:LQH31MN470K03L: Datasheet https://docs-emea.rs-online.com/webdocs/121d/0900766b8121da8e.pdf; COST: 0.611; OC_NEWARK: unknown; OC_RS: 469-2883
PMOS1 = LM_library:SIS407DN: SIS407DN-T1-GE3 - VISHAY MOSFET, P CH, -20V, -25A, PPAK1212-8; MPN: SIS407DN-T1-GE3; OC_EC: SIS407DN; OC_FARNELL: 1859001; OC_MOUSER: 781-SIS407DN-T1-GE3; OC_NEWARK: 09X6415
R1 R4 = LM_library:R2MR0603; OC_NEWARK: unknown
R2 R90 R91 = LM_library:R390KR0603; OC_NEWARK: unknown
R3 = LM_library:R270KR0603; MPN: MC0603N270K500CT; OC_NEWARK: 06R5158
R5 R6 R15 R20 = LM_library:R180KR0603; OC_NEWARK: unknown
R7 R8 R21 R61 R67 R89 R93 = LM_library:R10KR0603; DESCRIPTION: 10k Ohm ±1% 0.1W, 1/10W Chip Resistor 0603; OC_NEWARK: unknown
R9-R11 R24 R56 R57 R65 R68-R72 = LM_library:R100KR0603; DESCRIPTION: 100k Ohm ±1% 0.1W, 1/10W Chip Resistor 0603; OC_NEWARK: unknown
R12 R13 R16 R17 R22 R43 R46 R77 R144 R145 = LM_library:R10MR0603; OC_EC: CRCW060310M0FKEA; OC_NEWARK: unknown
R14 R73 = LM_library:R3K3R0603; OC_NEWARK: unknown
R18 = LM_library:R499KR0603; MPN: CRCW0201499KFKED; OC_NEWARK: 01X2013
R19 = LM_library:RESISTOR: Resistor Basic schematic elements and footprints for 0603, 1206, and PTH resistors.; MPN: ERJ3EKF4700V; OC_NEWARK: 85Y8745
R23 R25 R29 = LM_library:R1KR0603: R0603 1k 1% chip resistor; OC_EC: GPR06031K
R26 R92 = LM_library:RESISTOR: Resistor Basic schematic elements and footprints for 0603, 1206, and PTH resistors.; OC_NEWARK: unknown
R28 R40 R42 R62 = LM_library:R1MR0603; OC_NEWARK: unknown
R30 = LM_library:R0RR0603; OC_EC: CR0603-J/-000ELF; OC_NEWARK: 02J2264
R41 R55 R63 R80 = LM_library:R1KR0603: R0603 1k 1% chip resistor; OC_EC: GPR06031K; OC_NEWARK: unknown
R48 R49 = LM_library:RESISTOR: Resistor Basic schematic elements and footprints for 0603, 1206, and PTH resistors.; DESCRIPTION: 0603, Res 10.0Ohm, 50V, 1.0%, 100mW; OC_NEWARK: unknown
R51 R58 R83 R84 = LM_library:R820RR0603; OC_EC: GPR0603820R; OC_NEWARK: unknown
R64 = LM_library:R4K7R0603; OC_NEWARK: unknown
R66 = LM_library:R390RR0603; OC_NEWARK: unknown
RL3-RL12 = LM_library:AQY210S; MPN: AQY210SX; OC_FARNELL: 3105313; OC_MOUSER: 769-AQY210S; OC_NEWARK: 10C4004
RSENSE = LM_library:R20RR2010; OC_NEWARK: unknown
T4 = LM_library:ZVN4525ZTA: " ZVN4525ZTA - Diodes Incorporated MOSFET N-CH 250V 240MA SOT-89"; OC_MOUSER: 522-ZVN4525ZTA; OC_NEWARK: unknown
T25 = LM_library:ZVP4525ZTA: " ZVP4525ZTA - Diodes Incorporated MOSFET P-CH 250V 0.205A SOT-89"; OC_MOUSER: 522-ZVP4525ZTA; OC_NEWARK: unknown
TP14 TP15 = testpad:TP: Test pad; OC_NEWARK: unknown
TR1 = LM_library:ATB322524-0110-T000; DESCR: K 1:10.2 L=7uH; MPN: ATB322524-0110-T000; OC_MOUSER: 810-ATB32240110T000; OC_NEWARK: 39Y3258
TR1A = Mecfes_RT:LDT565630T: TRANSFORMER SMD converter and transformer acc. to customer specification; OC_NEWARK: unknown
U1 U2 = LM_library:ADP160AUJZ-3.3-R7: 150 mA, CMOS Linear Regulators; DESCRIPTION: PACK - TSOT-5; MPN: MIC5255-3.3YM5-TR; OC_FARNELL: -; OC_NEWARK: 30AC9897
U3 = LM_library:TPS61020DRCRG4: 96% EFFICIENT SYNCHRONOUS BOOST CONVERTER; DESCRIPTION: SON-10; MPN: TPS61020DRCRG4; OC_FARNELL: 9969160; OC_NEWARK: 79K3407
U4 U18 = LM_library:AD8232; MPN: AD8232ACPZ-R7; OC_FARNELL: 2460980; OC_MOUSER: 584-AD8232ACPZ-R7; OC_NEWARK: 39Y2896
U5 = ADUCM360:ADUCM360BCPZ128; MPN: ADUCM360BCPZ128; OC_NEWARK: 46W3356
U13 = LM_library:LT3484: LT3484EDCB-2#TRMPBF - Linear Technology/Analog Devices IC PHOTOFLASH CAP CHARGER 6-DFN; DESCR: Charge Pin. A low (<0.3V) to high (>1V) transition on this pin puts the part into power delivery mode Bringing the pin low (<0.3V) will terminate; OC_DIGIKEY: LT3484EDCB-2#TRMPBFCT-ND; OC_NEWARK: unknown
U15-U17 = LM_library:AD8642A: Precision, Very Low Noise, Low Input Bias Current, Wide Bandwidth JFET Operational Amplifiers; MPN: AD8642ARMZ; OC_FARNELL: 2376744; OC_NEWARK: 23X6319
X1 = LM_library:ABS05-32.768KHZ-T: SMD LOW PROFILE CRYSTAL 1.6 x 1.0 x 0.5mm http://www.digikey.com/product-detail/en/ABS05-32.768KHZ-9-T/535-11897-1-ND/35080692; OC_FARNELL: 2467859; OC_MOUSER: 815-ABS05-32.768K-T; OC_NEWARK: unknown
X4 = con-amp-micromatch:MICROMATCH-8: MicroMaTch 8 7-215464-8 / 0-215464-8 Drawing Number C-215464 DDEController.pdf; MF: FARNELL; MPN: 7-215464-8; OC_FARNELL: 3784642; OC_NEWARK: 26H0301
X6 = LM_library:MICROMATCH-20: MicroMaTch 20 9-215464-0 / 2-215464-0 Drawing Number C-215464 DDEController.pdf; MPN: 2-215079-0; OC_NEWARK: 17R7376; OC_RS: 341-7704
X7 = LM_library:MICROMATCH-20: MicroMaTch 20 9-215464-0 / 2-215464-0 Drawing Number C-215464 DDEController.pdf; OC_NEWARK: unknown; OC_RS: 341-7704
X9 = con-molex:C-GRID-14: CONNECTOR wire to board 2.54 mm (0.100") pitch header; OC_FARNELL: unknown; OC_NEWARK: unknown
ZD1 ZD3 = diodes:KDZLVTFTR150: KDZLVTFTR150 - ROHM ZENER DIODE, AEC-Q101, 1W, SOD-123FL RT/180621; FARNEL_OC: 2580864RL; OC_EC: KDZLVTFTR150; OC_NEWARK: unknown; PRICE: 0.4; VZ: 150

## Net classes
0 default: width 0.25 mm, drill 0.3 mm, clearance 0.15 mm
1 pwr: width 0.5 mm, drill 0.3 mm, clearance 0.2 mm to class 0, clearance 0.2 mm
2 cHVP: width 0.5 mm, drill 0.3 mm, clearance 0.4 mm to class 0, clearance 0.4 mm to class 1, clearance 0.25 mm
3 cVHN: width 0.5 mm, drill 0.3 mm, clearance 0.4 mm to class 0, clearance 0.4 mm to class 1, clearance 0.8 mm to class 2, clearance 0.25 mm
4 cHV: width 0.25 mm, drill 0.3 mm, clearance 0.8 mm to class 0, clearance 0.8 mm to class 1, clearance 0.8 mm to class 2, clearance 0.8 mm to class 3, clearance 0.8 mm
5 cPPLS: width 0.5 mm, drill 0.3 mm, clearance 0.4 mm to class 0, clearance 0.4 mm to class 1, clearance 0.8 mm to class 2, clearance 0.8 mm to class 3, clearance 0.4 mm to class 4, clearance 0.25 mm
6 cNPLS: width 0.5 mm, drill 0.3 mm, clearance 0.4 mm to class 0, clearance 0.4 mm to class 1, clearance 0.8 mm to class 2, clearance 0.8 mm to class 3, clearance 0.4 mm to class 4, clearance 0.4 mm to class 5, clearance 0.25 mm
7 cGnd: width 0.4 mm, drill 0.2 mm, clearance 0.2 mm to class 0, clearance 0.2 mm to class 1, clearance 0.2 mm to class 2, clearance 0.2 mm to class 3, clearance 0.2 mm to class 4, clearance 0.2 mm to class 5, clearance 0.2 mm to class 6
8 signal: width 0.2 mm, drill 0.3 mm, clearance 0.2 mm to class 0, clearance 0.25 mm to class 1, clearance 0.8 mm to class 2, clearance 0.8 mm to class 3, clearance 0.8 mm to class 4, clearance 0.8 mm to class 5, clearance 0.8 mm to class 6, clearance 0.2 mm to class 7, clearance 0.2 mm